# Altium project Evb board STM32F2 Fullcolor V1l0.PrjPcb
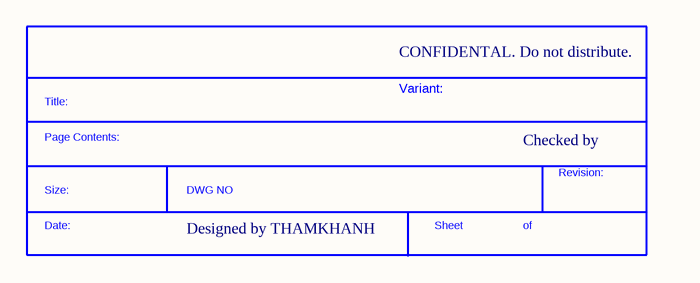
[diagram p0: [02] - BLOCK DIAGRAM.SchDoc]
ClientCompanyName: KAIO; ClientContactEmail: thamkhanhdev@gmail.com; ClientContactName: Khanh Tham; ClientWebsite: Reserved; Company: (c) 2019 KAIO; Note: FREE for personal.; NotFitted: NF; Project: Evb board STM32F2 Fullcolor; VersionRevision: V1I0
4 sheets, 63 parts. Net scope: flat (ports and power ports of the same name join across sheets).
Board file: Evb board STM32F2 Fullcolor V1l0.PcbDoc
Sheets:
  [02] - BLOCK DIAGRAM.SchDoc
  [03] - MAIN FUNC.SchDoc
  [04] - RESERVED CONNECTION.SchDoc
  [05] - REVISION HISTORY.SchDoc

## Sheet [02] - BLOCK DIAGRAM.SchDoc
size A3; DocumentNumber: 2; SheetNumber: 2; SheetTotal: 7

### Parts
(Parts that share a designator on the sheet are numbered #1, #2 ... from top to bottom, then left to right.)
*?#1  SDTitleBlock  (value not drawn)  (graphical)

### Notes on the sheet
- CONFIDENTAL. Do not distribute.
- Variant:
- Checked by
- Designed by THAMKHANH
- (in symbol SDTitleBlock) Title:; Page Contents:; Revision:; Size:; DWG NO; Date:; Sheet; of

## Sheet [03] - MAIN FUNC.SchDoc
size A3; DocumentNumber: 3; SheetNumber: 3; SheetTotal: 7
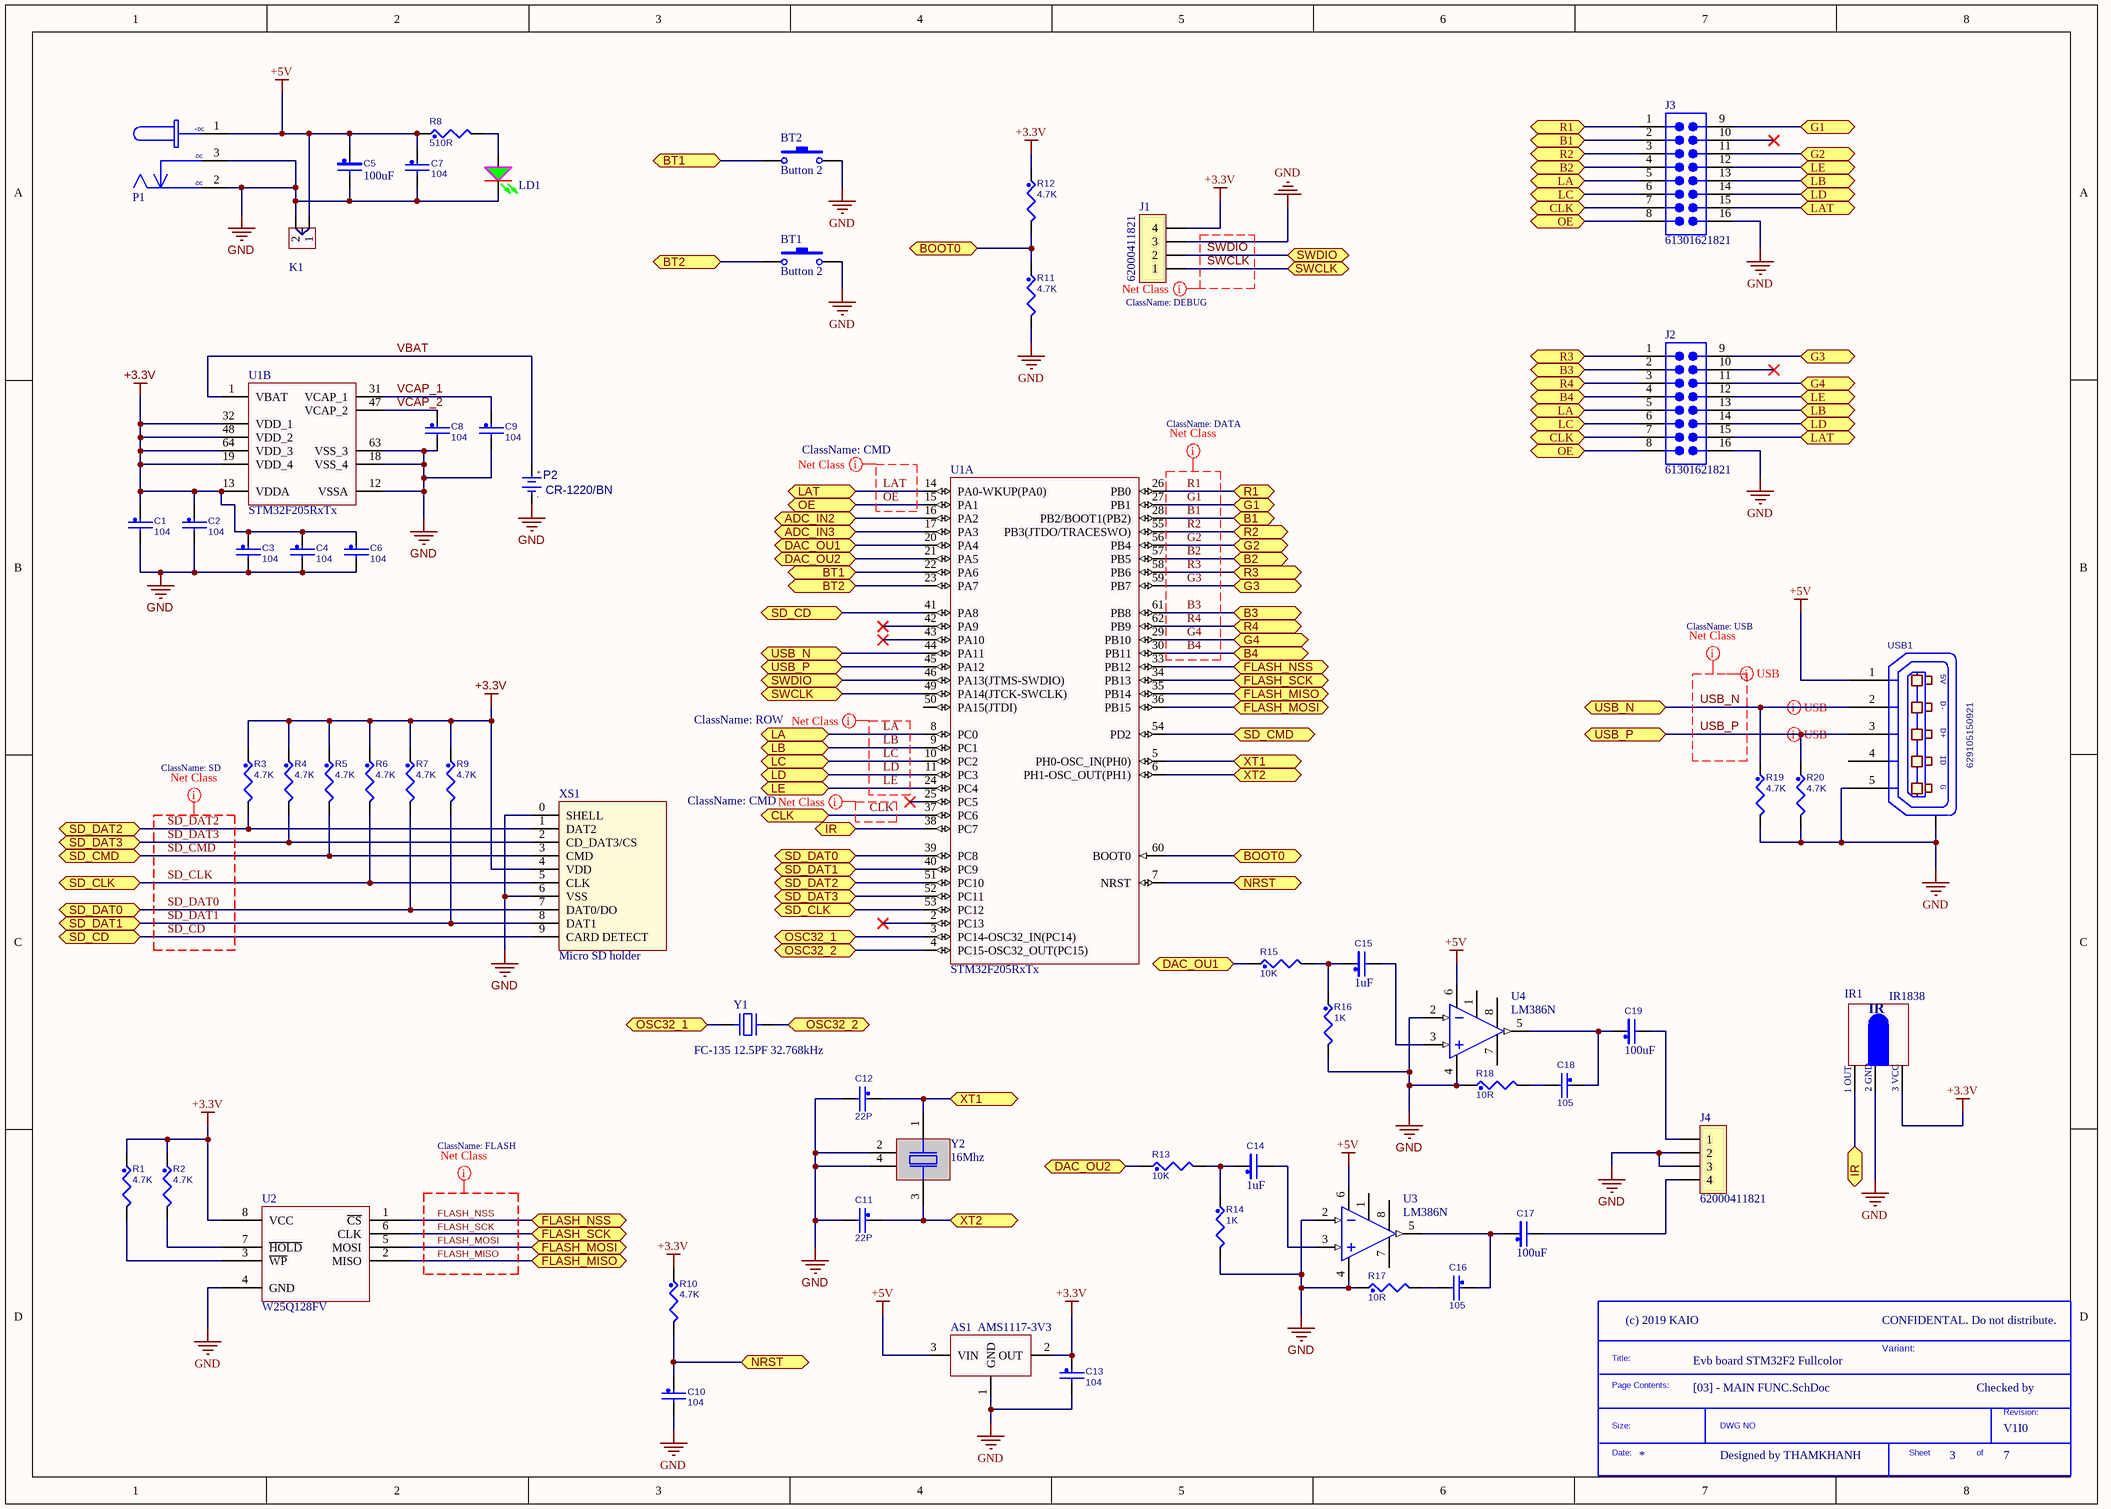
[diagram p1: [03] - MAIN FUNC.SchDoc]

### Parts
(Parts that share a designator on the sheet are numbered #1, #2 ... from top to bottom, then left to right.)
*?#2  SDTitleBlock  (value not drawn)  (graphical)
AS1  AMS1117-3V3  [SOT223-BCE]
BT1  Button 2  [BT-2P0604B1V]
BT2  Button 2  [BT-2P0604B1V]
C1  104  [C0603]
C2  104  [C0603]
C3  104  [C0603]
C4  104  [C0603]
C5  100uF  [CAP-TAN-SMD-3530]
C6  104  [C0603]
C7  104  [C0603]
C8  104  [C0603]
C9  104  [C0603]
C10  104  [C0603]
C11  22P  [C0603]
C12  22P  [C0603]
C13  104  [C0603]
C14  1uF  [CAP-TAN-SMD-3216]
C15  1uF  [CAP-TAN-SMD-3216]
C16  105  [C0603]
C17  100uF  [CAP-TAN-SMD-3530]
C18  105  [C0603]
C19  100uF  [CAP-TAN-SMD-3530]
IR1  IR1838  [IR RECEIVE V1]
J1  62000411821  [62000411121]
J2  61301621821  [61301621821]
J3  61301621821  [61301621821]
J4  62000411821  [62000411121]
K1  KF2  [KF5.08 2DV]  (value not drawn)
LD1  LED SMD  [LED 0805/2012 BLUE]  (value not drawn)
P1  DCIN  [DC-694108301002]  (value not drawn)
P2  CR-1220/BN  [PIN-CR1220-SMD]
R1  4.7K  [R0603]
R2  4.7K  [R0603]
R3  4.7K  [R0603]
R4  4.7K  [R0603]
R5  4.7K  [R0603]
R6  4.7K  [R0603]
R7  4.7K  [R0603]
R8  510R  [R0603]
R9  4.7K  [R0603]
R10  4.7K  [R0603]
R11  4.7K  [R0603]
R12  4.7K  [R0603]
R13  10K  [R0603]
R14  1K  [R0603]
R15  10K  [R0603]
R16  1K  [R0603]
R17  10R  [R0603]
R18  10R  [R0603]
R19  4.7K  [R0603]
R20  4.7K  [R0603]
U1  STM32F205RxTx  [QFP50P1000X1000-64N]  (parts A,B of 2)
U2  W25Q128FV  [SOIC127P530X530-8N]
U3  LM386N  [SOIC127P390X490-8N]
U4  LM386N  [SOIC127P390X490-8N]
USB1  629105150921  [USB-629105150921]
XS1  Micro SD holder  [SD-CARD-MICRO-V3]
Y1  FC-135 12.5PF 32.768kHz  [XT2-3215-2V]
Y2  16Mhz  [XT4-2520NX-SA]

### Ports
ADC_IN2 (bidir), ADC_IN3 (bidir), B1 (bidir), B2 (bidir), B3 (bidir), B4 (bidir), BOOT0 (bidir), BT1 (bidir), BT2 (bidir), CLK (bidir), DAC_OU1 (bidir), DAC_OU2 (bidir), FLASH_MISO (bidir), FLASH_MOSI (bidir), FLASH_NSS (bidir), FLASH_SCK (bidir), G1 (bidir), G2 (bidir), G3 (bidir), G4 (bidir), IR (bidir), LA (bidir), LAT (bidir), LB (bidir), LC (bidir), LD (bidir), LE (bidir), NRST (bidir), OE (bidir), OSC32_1 (bidir), OSC32_2 (bidir), R1 (bidir), R2 (bidir), R3 (bidir), R4 (bidir), SD_CD (bidir), SD_CLK (bidir), SD_CMD (bidir), SD_DAT0 (bidir), SD_DAT1 (bidir), SD_DAT2 (bidir), SD_DAT3 (bidir), SWCLK (bidir), SWDIO (bidir), USB_N (bidir), USB_P (bidir), XT1 (bidir), XT2 (bidir)

### Nets
+3.3V: AS1.2(OUT) C1.1 C2.1 C3.1 C4.1 C6.1 C13.1 IR1.3(VCC) J1.4 R1.1 R2.1 R3.1 R4.1 R5.1 R6.1 R7.1 R9.1 R10.1 R12.1 U1.13(VDDA) U1.19(VDD_4) U1.32(VDD_1) U1.48(VDD_2) U1.64(VDD_3) U2.8(VCC) XS1.4(VDD)
+5V: AS1.3(VIN) C5.1 C7.1 K1.1 P1.1 R8.1 U3.6(+V) U4.6(+V) USB1.1(P1)
GND: AS1.1(GND) BT1.2 BT2.2 C1.2 C2.2 C3.2 C4.2 C5.2 C6.2 C7.2 C8.2 C9.2 C10.2 C11.2 C12.2 C13.2 IR1.2(GND) J1.3 J2.16 J3.16 J4.2 J4.3 K1.2 LD1.2(K) P1.2 P1.3 P2.2(GND) R11.2 R14.2 R16.2 R17.1 R18.1 R19.2 R20.2 U1.12(VSSA) U1.18(VSS_4) U1.63(VSS_3) U2.4(GND) U3.2(IN-) U3.4(-V) U4.2(IN-) U4.4(-V) USB1.0(GND) USB1.5(P5) XS1.0(SHELL) XS1.6(VSS) Y2.2(GND) Y2.4(GND)
ADC_IN2: U1.16(PA2) ; port ADC_IN2
ADC_IN3: U1.17(PA3) ; port ADC_IN3
B1: J3.2 U1.28(PB2/BOOT1(PB2)) ; port B1
B2: J3.4 U1.57(PB5) ; port B2
B3: J2.2 U1.61(PB8) ; port B3
B4: J2.4 U1.30(PB11) ; port B4
BOOT0: R11.1 R12.2 U1.60(BOOT0) ; port BOOT0
BT1: BT2.1 U1.22(PA6) ; port BT1
BT2: BT1.1 U1.23(PA7) ; port BT2
CLK: J2.7 J3.7 U1.37(PC6) ; port CLK
DAC_OU1: R15.1 U1.20(PA4) ; port DAC_OU1
DAC_OU2: R13.1 U1.21(PA5) ; port DAC_OU2
FLASH_MISO: U1.35(PB14) U2.2(MISO) ; port FLASH_MISO
FLASH_MOSI: U1.36(PB15) U2.5(MOSI) ; port FLASH_MOSI
FLASH_NSS: U1.33(PB12) U2.1(~{CS}) ; port FLASH_NSS
FLASH_SCK: U1.34(PB13) U2.6(CLK) ; port FLASH_SCK
G1: J3.9 U1.27(PB1) ; port G1
G2: J3.11 U1.56(PB4) ; port G2
G3: J2.9 U1.59(PB7) ; port G3
G4: J2.11 U1.29(PB10) ; port G4
IR: IR1.1(Out) U1.38(PC7) ; port IR
LA: J2.5 J3.5 U1.8(PC0) ; port LA
LAT: J2.15 J3.15 U1.14(PA0-WKUP(PA0)) ; port LAT
LB: J2.13 J3.13 U1.9(PC1) ; port LB
LC: J2.6 J3.6 U1.10(PC2) ; port LC
LD: J2.14 J3.14 U1.11(PC3) ; port LD
LE: J2.12 J3.12 U1.24(PC4) ; port LE
NRST: C10.1 R10.2 U1.7(NRST) ; port NRST
OE: J2.8 J3.8 U1.15(PA1) ; port OE
OSC32_1: U1.3(PC14-OSC32_IN(PC14)) Y1.1 ; port OSC32_1
OSC32_2: U1.4(PC15-OSC32_OUT(PC15)) Y1.2 ; port OSC32_2
R1: J3.1 U1.26(PB0) ; port R1
R2: J3.3 U1.55(PB3(JTDO/TRACESWO)) ; port R2
R3: J2.1 U1.58(PB6) ; port R3
R4: J2.3 U1.62(PB9) ; port R4
SD_CD: U1.41(PA8) XS1.9(CARD_DETECT) ; port SD_CD
SD_CLK: R6.2 U1.53(PC12) XS1.5(CLK) ; port SD_CLK
SD_CMD: R5.2 U1.54(PD2) XS1.3(CMD) ; port SD_CMD
SD_DAT0: R7.2 U1.39(PC8) XS1.7(DAT0/DO) ; port SD_DAT0
SD_DAT1: R9.2 U1.40(PC9) XS1.8(DAT1) ; port SD_DAT1
SD_DAT2: R3.2 U1.51(PC10) XS1.1(DAT2) ; port SD_DAT2
SD_DAT3: R4.2 U1.52(PC11) XS1.2(CD_DAT3/CS) ; port SD_DAT3
SWCLK: J1.1 U1.49(PA14(JTCK-SWCLK)) ; port SWCLK
SWDIO: J1.2 U1.46(PA13(JTMS-SWDIO)) ; port SWDIO
USB_N: R19.1 U1.44(PA11) USB1.2(P2) ; port USB_N
USB_P: R20.1 U1.45(PA12) USB1.3(P3) ; port USB_P
VBAT: P2.1(+3V) U1.1(VBAT)
VCAP_1: C9.1 U1.31(VCAP_1)
VCAP_2: C8.1 U1.47(VCAP_2)
XT1: C12.1 U1.5(PH0-OSC_IN(PH0)) Y2.1(X1) ; port XT1
XT2: C11.1 U1.6(PH1-OSC_OUT(PH1)) Y2.3(X2) ; port XT2
NetC14_1: C14.1 R13.2 R14.1
NetC14_2: C14.2 U3.3(IN+)
NetC15_1: C15.1 R15.2 R16.1
NetC15_2: C15.2 U4.3(IN+)
NetC16_1: C16.1 C17.1 U3.5(OUT)
NetC16_2: C16.2 R17.2
NetC17_2: C17.2 J4.4
NetC18_1: C18.1 C19.1 U4.5(OUT)
NetC18_2: C18.2 R18.2
NetC19_2: C19.2 J4.1
NetLD1_1: LD1.1(A) R8.2
NetR1_2: R1.2 U2.3(~{WP})
NetR2_2: R2.2 U2.7(~{HOLD})

Not connected (* = marked no-connect by the designer): J2 10*; J3 10*; U1 2(PC13)* 25(PC5)* 42(PA9)* 43(PA10)* 50(PA15(JTDI)); U3 1(-V) 7 8(-V); U4 1(-V) 7 8(-V); USB1 4(P4)

### Layout directives
differential pair: USB_N, USB_P
net class FLASH: FLASH_MISO, FLASH_MOSI, FLASH_NSS, FLASH_SCK
net class SD: SD_CD, SD_CLK, SD_CMD, SD_DAT0, SD_DAT1, SD_DAT2, SD_DAT3
net class USB: USB_N, USB_P
net class DATA: B1, B2, B3, B4, G1, G2, G3, G4, R1, R2, R3, R4
net class ROW: LA, LB, LC, LD, LE
net class CMD: CLK, LAT, OE
net class DEBUG: SWCLK, SWDIO

### Notes on the sheet
- CONFIDENTAL. Do not distribute.
- Variant:
- Checked by
- Designed by THAMKHANH
- (in symbol DCIN) +DC; -DC
- (in symbol IR1838) IR; 1 OUT; 2 GND; 3 VCC
- (in symbol PIN-CR-1220/BN) +; -
- (in symbol SDTitleBlock) Title:; Page Contents:; Revision:; Size:; DWG NO; Date:; Sheet; of
- (in symbol USB 2.0 Micro Type AB Female) 5V; D-; D+; ID; G

### Library data of the parts
AS1 = AMS1117-3V3: 800mA Low-Dropout Linear Regulator
BT1 BT2 = Button 2: Button 2 Pin no Sheld
C1-C4 C6-C13 C16 C18 = CAP-SMD-CERAMIC: Surface Mound Multilayer Ceramic Chip Capacitor (SMD MLCC); Manufacturer: TDK Corporation; Manufacturer Part Number: C2012X5R1C226K; Capacitance: 22pF; Voltage - Rated: 16V; Tolerance: ±10%; Temperature Coefficient: X5R; .Checked PCB: RF; RoHS: RoHS Compliant; Category: Capacitors; Mounting Type: Surface Mount, MLCC; Operating Temperature: -55°C ~ 85°C; Applications: General Purpose; Ratings: -; Package / Case: 0805 (2012 Metric); Size / Dimension: 0.079" L x 0.049" W (2.00mm x 1.25mm); Height - Seated (Max): -; Thickness (Max): 0.057" (1.45mm); Lead Spacing: -; Features: -; Packaging: Cut Tape (CT); Lead Style: -; ComponentLink1URL: http://www.tdk.com/pdf/general_B11.pdf; ComponentLink1Description: http://www.tdk.com/pdf/general_B11.pdf; .Checked SCH: RF
C5 C17 C19 = CAP-SMD-TANTALUM: Tantalum capacitor , T491A475K016AT, KEMET; Manufacturer Part Number: T491A105K016AT; Capacitance: 1uF; Tolerance: 20%; Voltage Rating: 16V; ESR (Equivalent Series Resistance): 10R; Leakage Current: 500nA; Polarity: Polar; Dissipation Factor: 4%; Life (Hours): 2000Hour; Ripple Current: 87mA; Manufacturer: KEMET; Mount: Surface Mount,PCB; Case/Package: 1206; Number of Pins: 2; Case Code (Imperial): 1206; Case Code (Metric): 3216; Dielectric Material: Tantalum; Min Operating Temperature: -55°C; Max Operating Temperature: 125°C; Packaging: Tape and Reel; Package Quantity: 1; Voltage Rating (DC): 16V; Termination: SMD/SMT; Voltage: 16V; Features: General Purpose; Length: 3.2mm; Height: 1.6mm; Width: 1.6mm; Height - Seated (Max): 0.071inch; Depth: 1.6mm; REACH SVHC: No SVHC; Lead Free: Lead Free; ComponentLink1URL: https://4donline.ihs.com/images/VipMasterIC/IC/KEME/KEME-S-A0006487387/KEME-S-A0006487387-1.pdf?hkey=52A5661711E402568146F3353EA87419&src-supplier=Element14; ComponentLink1Description: https://4donline.ihs.com/images/VipMasterIC/IC/KEME/KEME-S-A0006487387/KEME-S-A0006487387-1.pdf?hkey=52A5661711E402568146F3353EA87419&src-supplier=Element14; ComponentLink2URL: http://www.rapidonline.com/pdf/458280_da_en_01.pdf?src-supplier=Rapid+Electronics; ComponentLink2Description: http://www.rapidonline.com/pdf/458280_da_en_01.pdf?src-supplier=Rapid+Electronics; ComponentLink3URL: http://www.jameco.com/Jameco/Products/ProdDS/1573169.pdf?src-supplier=Jameco; ComponentLink3Description: http://www.jameco.com/Jameco/Products/ProdDS/1573169.pdf?src-supplier=Jameco; ComponentLink4URL: http://www.kemet.com/kemet/web/homepage/kechome.nsf/file/T491%20Series/$file/KEM_T2005_T491.pdf?src-supplier=Farnell; ComponentLink4Description: http://www.kemet.com/kemet/web/homepage/kechome.nsf/file/T491%20Series/$file/KEM_T2005_T491.pdf?src-supplier=Farnell; ComponentLink5URL: http://www.mouser.com/ds/2/212/KEM_T2005_T491-1093550.pdf?src-supplier=Mouser; ComponentLink5Description: http://www.mouser.com/ds/2/212/KEM_T2005_T491-1093550.pdf?src-supplier=Mouser; ComponentLink6URL: https://www.distrelec.biz/Web/Downloads/_t/ds/KEM_T2005_T491_eng_tds.pdf?mime=application%2Fpdf&src-supplier=Distrelec; ComponentLink6Description: https://www.distrelec.biz/Web/Downloads/_t/ds/KEM_T2005_T491_eng_tds.pdf?mime=application%2Fpdf&src-supplier=Distrelec; ComponentLink7URL: https://api.kemet.com/component-edge/download/datasheet/T491A105K016AT.pdf?src-supplier=Digi-Key; ComponentLink7Description: https://api.kemet.com/component-edge/download/datasheet/T491A105K016AT.pdf?src-supplier=Digi-Key; ComponentLink8URL: http://www.kemet.com/kemet/web/homepage/kechome.nsf/file/T491%20Series/$file/KEM_T2005_T491.pdf?src-supplier=Element14; ComponentLink8Description: http://www.kemet.com/kemet/web/homepage/kechome.nsf/file/T491%20Series/$file/KEM_T2005_T491.pdf?src-supplier=Element14; ComponentLink9URL: http://uk.rs-online.com/webdocs/1529/0900766b815290c9.pdf?src-supplier=RSComponents; ComponentLink9Description: http://uk.rs-online.com/webdocs/1529/0900766b815290c9.pdf?src-supplier=RSComponents; ComponentLink10URL: https://www.alliedelec.com/m/d/1172a60f7bb3eb66344f86e8fb9ddbde.pdf?src-supplier=Allied+Electronics; ComponentLink10Description: https://www.alliedelec.com/m/d/1172a60f7bb3eb66344f86e8fb9ddbde.pdf?src-supplier=Allied+Electronics; Radiation Hardening: No; ComponentLink11URL: https://api.kemet.com/component-edge/download/datasheet/T491A475K016AT.pdf?src-supplier=Digi-Key; ComponentLink11Description: https://api.kemet.com/component-edge/download/datasheet/T491A475K016AT.pdf?src-supplier=Digi-Key; ComponentLink12URL: http://www.jameco.com/Jameco/Products/ProdDS/1573425.pdf?src-supplier=Jameco; ComponentLink12Description: http://www.jameco.com/Jameco/Products/ProdDS/1573425.pdf?src-supplier=Jameco; ComponentLink13URL: http://uk.rs-online.com/webdocs/1515/0900766b81515525.pdf?src-supplier=RSComponents; ComponentLink13Description: http://uk.rs-online.com/webdocs/1515/0900766b81515525.pdf?src-supplier=RSComponents; ComponentLink14URL: http://www.farnell.com/datasheets/1854511.pdf?src-supplier=Element14; ComponentLink14Description: http://www.farnell.com/datasheets/1854511.pdf?src-supplier=Element14; ComponentLink15URL: http://www.rapidonline.com/pdf/458253_da_en_01.pdf?src-supplier=Rapid+Electronics; ComponentLink15Description: http://www.rapidonline.com/pdf/458253_da_en_01.pdf?src-supplier=Rapid+Electronics; ComponentLink16URL: https://produktinfo.conrad.com/datenblaetter/450000-474999/458253-da-01-en-TANTAL_KONDENSATOR_T491A475K016AT.pdf?src-supplier=Conrad; ComponentLink16Description: https://produktinfo.conrad.com/datenblaetter/450000-474999/458253-da-01-en-TANTAL_KONDENSATOR_T491A475K016AT.pdf?src-supplier=Conrad
C14 C15 = CAP-SMD-TANTALUM: Tantalum capacitor , T491A475K016AT, KEMET; Manufacturer Part Number: T491A105K016AT; Tolerance: 20%; Voltage Rating: 16V; ESR (Equivalent Series Resistance): 10R; Leakage Current: 500nA; Polarity: Polar; Dissipation Factor: 4%; Life (Hours): 2000Hour; Ripple Current: 87mA; Manufacturer: KEMET; Mount: Surface Mount,PCB; Case/Package: 1206; Number of Pins: 2; Case Code (Imperial): 1206; Case Code (Metric): 3216; Dielectric Material: Tantalum; Min Operating Temperature: -55°C; Max Operating Temperature: 125°C; Capacitance: 1uF; Packaging: Tape and Reel; Package Quantity: 1; Voltage Rating (DC): 16V; Termination: SMD/SMT; Voltage: 16V; Features: General Purpose; Length: 3.2mm; Height: 1.6mm; Width: 1.6mm; Height - Seated (Max): 0.071inch; Depth: 1.6mm; REACH SVHC: No SVHC; Lead Free: Lead Free; ComponentLink1URL: https://4donline.ihs.com/images/VipMasterIC/IC/KEME/KEME-S-A0006487387/KEME-S-A0006487387-1.pdf?hkey=52A5661711E402568146F3353EA87419&src-supplier=Element14; ComponentLink1Description: https://4donline.ihs.com/images/VipMasterIC/IC/KEME/KEME-S-A0006487387/KEME-S-A0006487387-1.pdf?hkey=52A5661711E402568146F3353EA87419&src-supplier=Element14; ComponentLink2URL: http://www.rapidonline.com/pdf/458280_da_en_01.pdf?src-supplier=Rapid+Electronics; ComponentLink2Description: http://www.rapidonline.com/pdf/458280_da_en_01.pdf?src-supplier=Rapid+Electronics; ComponentLink3URL: http://www.jameco.com/Jameco/Products/ProdDS/1573169.pdf?src-supplier=Jameco; ComponentLink3Description: http://www.jameco.com/Jameco/Products/ProdDS/1573169.pdf?src-supplier=Jameco; ComponentLink4URL: http://www.kemet.com/kemet/web/homepage/kechome.nsf/file/T491%20Series/$file/KEM_T2005_T491.pdf?src-supplier=Farnell; ComponentLink4Description: http://www.kemet.com/kemet/web/homepage/kechome.nsf/file/T491%20Series/$file/KEM_T2005_T491.pdf?src-supplier=Farnell; ComponentLink5URL: http://www.mouser.com/ds/2/212/KEM_T2005_T491-1093550.pdf?src-supplier=Mouser; ComponentLink5Description: http://www.mouser.com/ds/2/212/KEM_T2005_T491-1093550.pdf?src-supplier=Mouser; ComponentLink6URL: https://www.distrelec.biz/Web/Downloads/_t/ds/KEM_T2005_T491_eng_tds.pdf?mime=application%2Fpdf&src-supplier=Distrelec; ComponentLink6Description: https://www.distrelec.biz/Web/Downloads/_t/ds/KEM_T2005_T491_eng_tds.pdf?mime=application%2Fpdf&src-supplier=Distrelec; ComponentLink7URL: https://api.kemet.com/component-edge/download/datasheet/T491A105K016AT.pdf?src-supplier=Digi-Key; ComponentLink7Description: https://api.kemet.com/component-edge/download/datasheet/T491A105K016AT.pdf?src-supplier=Digi-Key; ComponentLink8URL: http://www.kemet.com/kemet/web/homepage/kechome.nsf/file/T491%20Series/$file/KEM_T2005_T491.pdf?src-supplier=Element14; ComponentLink8Description: http://www.kemet.com/kemet/web/homepage/kechome.nsf/file/T491%20Series/$file/KEM_T2005_T491.pdf?src-supplier=Element14; ComponentLink9URL: http://uk.rs-online.com/webdocs/1529/0900766b815290c9.pdf?src-supplier=RSComponents; ComponentLink9Description: http://uk.rs-online.com/webdocs/1529/0900766b815290c9.pdf?src-supplier=RSComponents; ComponentLink10URL: https://www.alliedelec.com/m/d/1172a60f7bb3eb66344f86e8fb9ddbde.pdf?src-supplier=Allied+Electronics; ComponentLink10Description: https://www.alliedelec.com/m/d/1172a60f7bb3eb66344f86e8fb9ddbde.pdf?src-supplier=Allied+Electronics; Radiation Hardening: No; ComponentLink11URL: https://api.kemet.com/component-edge/download/datasheet/T491A475K016AT.pdf?src-supplier=Digi-Key; ComponentLink11Description: https://api.kemet.com/component-edge/download/datasheet/T491A475K016AT.pdf?src-supplier=Digi-Key; ComponentLink12URL: http://www.jameco.com/Jameco/Products/ProdDS/1573425.pdf?src-supplier=Jameco; ComponentLink12Description: http://www.jameco.com/Jameco/Products/ProdDS/1573425.pdf?src-supplier=Jameco; ComponentLink13URL: http://uk.rs-online.com/webdocs/1515/0900766b81515525.pdf?src-supplier=RSComponents; ComponentLink13Description: http://uk.rs-online.com/webdocs/1515/0900766b81515525.pdf?src-supplier=RSComponents; ComponentLink14URL: http://www.farnell.com/datasheets/1854511.pdf?src-supplier=Element14; ComponentLink14Description: http://www.farnell.com/datasheets/1854511.pdf?src-supplier=Element14; ComponentLink15URL: http://www.rapidonline.com/pdf/458253_da_en_01.pdf?src-supplier=Rapid+Electronics; ComponentLink15Description: http://www.rapidonline.com/pdf/458253_da_en_01.pdf?src-supplier=Rapid+Electronics; ComponentLink16URL: https://produktinfo.conrad.com/datenblaetter/450000-474999/458253-da-01-en-TANTAL_KONDENSATOR_T491A475K016AT.pdf?src-supplier=Conrad; ComponentLink16Description: https://produktinfo.conrad.com/datenblaetter/450000-474999/458253-da-01-en-TANTAL_KONDENSATOR_T491A475K016AT.pdf?src-supplier=Conrad
IR1 = IR1838: VISHAY SEMICONDUCTOR   TSOP31238   IR RECEIVER, 40M, 38KHZ, SIP
J1 J4 = JP4 2.00MM Single Socket: WR-PHD 2.00 mm Socket Header; Manufacturer: W¨¹rth Elektronik eiSos GmbH; ComponentLink1 Description: Manufacturer; ComponentLink2 Description: Datasheet; NoPins: 04; Created Date: 2 April 2013; partNo: 62000411821; ComponentLink1URL: http://www.we-online.com; ComponentLink2URL: http://katalog.we-online.de/em/datasheet/6200xx11821.pdf; Created by: Karrer Zheng
J2 J3 = JP8 2.54MM Dual Socket: 2.54 mm Dual Socket Header, 16p; PublishedDate: July 2016; Publisher: Wurth Elektronik; ComponentLink1Description: Manufacturer; ComponentLink1URL: http://www.we-online.de; ComponentLink2Description: Datasheet; ComponentLink2URL: http://katalog.we-online.de/em/datasheet/6130xx21821.pdf; PartNumber: 61301621821; PinNumber: 16p
K1 = KF2: KF2, 5.08mm, 10A, 300V, -40C ~ 105C
LD1 = LED SMD: LED DIFFUSED SMD
P1 = DCIN: TBD
P2 = PIN-CR-1220/BN: PANASONIC - CR-1220/BN - BATTERY, LITHIUM, CR1220; Capacity: 35mAh; Voltage Rating (DC): 3V; Outside Diameter: 12.5mm; Manufacturer: Panasonic; Manufacturer Part Number: CR-1220/BN; Weight: 1.2g; Min Operating Temperature: -30°C; Max Operating Temperature: 60°C; Chemistry/Technology: Lithium; Termination: Standard; Diameter: 12.5mm; Height: 2mm; Lead Free: Lead Free; REACH SVHC: Yes; ComponentLink1URL: http://uk.rs-online.com/webdocs/0c85/0900766b80c85259.pdf?src-supplier=RSComponents; ComponentLink1Description: http://uk.rs-online.com/webdocs/0c85/0900766b80c85259.pdf?src-supplier=RSComponents
R1-R20 = RES-SMD: RES 0R OHM 1/8W 1% SMD; Manufacturer: Yageo; Manufacturer Part Number: RC0402FR-0749R9L; Power (Watts): 0.063W, 1/16W; .Checked PCB: used; Temperature Coefficient: ±100ppm/°C; Resistance: 3.3kR; Power Rating: 125mW; Voltage Rating: 100V; Category: Resistors; Supplier Part Number: 311-49.9LRCT-ND; Package / Case: 0402 (1005 Metric); Price 1k [$]: 0.01421; Tolerance: ±1%; Value: 0R; .Checked SCH: used; Supplier: Digikey; RoHS: RoHS Compliant; Composition: Thick Film; Features: -; Size / Dimension: 0.039" L x 0.020" W (1.00mm x 0.50mm); Height: 0.016" (0.40mm); Number of Terminations: 2; Packaging: Cut Tape (CT); ComponentLink1URL: http://www.yageo.com/documents/recent/PYu-RC0402_51_RoHS_L_6.pdf; ComponentLink1Description: http://www.yageo.com/documents/recent/PYu-RC0402_51_RoHS_L_6.pdf; Resistance (Ohms): 0R; Mount: Surface Mount; Case/Package: 0805; Number of Pins: 2; Contact Plating: Tin; Case Code (Metric): 2012; Case Code (Imperial): 0805; Min Operating Temperature: -55°C; Max Operating Temperature: 155°C; Package Quantity: 1; Termination: SMD/SMT; Military Standard: Not; Max Power Dissipation: 125mW; Voltage Rating (DC): 100V; Length: 2mm; Width: 1.25mm; Depth: 1.25mm; Radiation Hardening: No; REACH SVHC: No SVHC; Lead Free: Lead Free; ComponentLink2URL: http://www.farnell.com/datasheets/485442.pdf?src-supplier=Farnell; ComponentLink2Description: http://www.farnell.com/datasheets/485442.pdf?src-supplier=Farnell; ComponentLink3URL: http://uk.rs-online.com/webdocs/0bee/0900766b80beefcc.pdf?src-supplier=RSComponents; ComponentLink3Description: http://uk.rs-online.com/webdocs/0bee/0900766b80beefcc.pdf?src-supplier=RSComponents; ComponentLink4URL: http://industrial.panasonic.com/www-data/pdf/AOA0000/AOA0000CE26.pdf?src-supplier=Future+Electronics; ComponentLink4Description: http://industrial.panasonic.com/www-data/pdf/AOA0000/AOA0000CE26.pdf?src-supplier=Future+Electronics; ComponentLink5URL: https://www.alliedelec.com/m/d/b6b0537e86f421aa7f5975bb1d8f429a.pdf?src-supplier=Allied+Electronics; ComponentLink5Description: https://www.alliedelec.com/m/d/b6b0537e86f421aa7f5975bb1d8f429a.pdf?src-supplier=Allied+Electronics; ComponentLink6URL: http://industrial.panasonic.com/www-data/pdf/AOA0000/AOA0000CE26.pdf?src-supplier=Avnet; ComponentLink6Description: http://industrial.panasonic.com/www-data/pdf/AOA0000/AOA0000CE26.pdf?src-supplier=Avnet; ComponentLink7URL: http://industrial.panasonic.com/www-data/pdf/AOA0000/AOA0000CE26.pdf?src-supplier=Avnet+Europe; ComponentLink7Description: http://industrial.panasonic.com/www-data/pdf/AOA0000/AOA0000CE26.pdf?src-supplier=Avnet+Europe; ComponentLink8URL: http://industrial.panasonic.com/cdbs/www-data/pdf/RDM0000/AOA0000C307.pdf?src-supplier=Farnell; ComponentLink8Description: http://industrial.panasonic.com/cdbs/www-data/pdf/RDM0000/AOA0000C307.pdf?src-supplier=Farnell; ComponentLink9URL: https://www.distrelec.biz/Web/Downloads/_t/ds/ERA_eng_tds.pdf?mime=application%2Fpdf&src-supplier=Distrelec; ComponentLink9Description: https://www.distrelec.biz/Web/Downloads/_t/ds/ERA_eng_tds.pdf?mime=application%2Fpdf&src-supplier=Distrelec; ComponentLink10URL: http://www.farnell.com/datasheets/485442.pdf?src-supplier=Element14; ComponentLink10Description: http://www.farnell.com/datasheets/485442.pdf?src-supplier=Element14; ComponentLink11URL: http://www.farnell.com/datasheets/2052875.pdf?src-supplier=Farnell; ComponentLink11Description: http://www.farnell.com/datasheets/2052875.pdf?src-supplier=Farnell; ComponentLink12URL: http://www.farnell.com/datasheets/2059650.pdf?src-supplier=Farnell; ComponentLink12Description: http://www.farnell.com/datasheets/2059650.pdf?src-supplier=Farnell; ComponentLink13URL: https://produktinfo.conrad.com/datenblaetter/450000-474999/453184-da-01-en-WIDERSTAND_0805_ERA.pdf?src-supplier=Conrad; ComponentLink13Description: https://produktinfo.conrad.com/datenblaetter/450000-474999/453184-da-01-en-WIDERSTAND_0805_ERA.pdf?src-supplier=Conrad
U1 = STM32F205RxTx: ARM Cortex-M3 32-bit MCU, 1024 KB Flash, 128 KB Internal RAM, 51 I/Os, 64-pin LQFP, -40 to 105 degC, Tray; PartNumber: STM32F205RGT7; D/A Converter: 2x12-bit (2 Channel); FLASH Size (Prog) (kB): 1024; I/Os (High Current): 51; Internal RAM Size (kB): 128; Operating Frequency(F) (Processor speed) (MHz): 120; Supply Voltage(Vcc) min (V): 1.8; DatasheetVersion: Rev. 9; PackageVersion: Rev. 4, 06/2013; PackageReference: LQFP64; PackageDescription: 64-Pin Low Profile Quad Flat Package, 10 x 10 mm Body, 0.5 mm Pitch; Core: ARM Cortex-M3; Packing: Tray; Mounting Technology: Surface Mount; ComponentLink1Description: Manufacturer URL; ComponentLink1URL: http://www.st.com/web/en/home.html; ComponentLink2Description: Datasheet; ComponentLink2URL: http://www.st.com/st-web-ui/static/active/en/resource/technical/document/datasheet/CD00237391.pdf; ComponentLink3Description: Package Specification; ComponentLink3URL: http://www.st.com/st-web-ui/static/active/en/resource/technical/document/datasheet/DM00037051.pdf
U3 U4 = LM386N: TEXAS INSTRUMENTS         LM386N-3/NOPB            AUDIO POWER AMPLIFIER, CLASS AB, 700mW DIP-8
USB1 = USB 2.0 Micro Type AB Female: Micro USB 2.0 Type AB; PartVertical: 614105150621; Interface Type: Type AB; Gender: Receptacle; ComponentLink1Description: Manufacturer; ComponentLink1URL: http://www.we-online.de; ComponentLink2Description: Datasheet; ComponentLink2URL: http://katalog.we-online.de/em/datasheet/629105150921.pdf; PartHorizontal: 629105150921; Published Date: April 2017; Publisher: Wurth Elektronik; Sub-Family: Micro USB 2.0; Type: Horizontal; Construction: SMT
XS1 = SD-CARD-v3
Y1 = XT2-ABLS-X.000MHZ-B2-T: CRYSTAL X.0000MHZ 18PF SMD; Manufacturer: Abracon; Manufacturer Part Number: ABLS-X.000MHZ-B4-T; Frequency Tolerance: 30ppm; Frequency: XMHz; ESR (Equivalent Series Resistance): 80R; Frequency Stability: 50ppm; Mount: Surface Mount; Case/Package: SMD/SMT; Min Operating Temperature: -20°C; Max Operating Temperature: 70°C; Packaging: Tape and Reel; Package Quantity: 1000; Load Capacitance: 18pF; Tolerance: 30ppm; Termination: SMD/SMT; Series Resistance: 80R; Length: 11.4mm; Height: 0.165inch; Depth: 4.7mm; Width: 0.185inch; Radiation Hardening: No; REACH SVHC: Yes; Lead Free: Lead Free; ComponentLink1URL: https://abracon.com/Support/PackageDrawing/Resonators/ABLS-2D.pdf?src-supplier=Digi-Key; ComponentLink1Description: https://abracon.com/Support/PackageDrawing/Resonators/ABLS-2D.pdf?src-supplier=Digi-Key; ComponentLink2URL: http://www.abracon.com/Support/PackageDrawing/Resonators/ABLS-2D.pdf?src-supplier=Avnet; ComponentLink2Description: http://www.abracon.com/Support/PackageDrawing/Resonators/ABLS-2D.pdf?src-supplier=Avnet; ComponentLink3URL: http://www.abracon.com/Support/PackageDrawing/Resonators/ABLS-2D.pdf?src-supplier=Mouser; ComponentLink3Description: http://www.abracon.com/Support/PackageDrawing/Resonators/ABLS-2D.pdf?src-supplier=Mouser
Y2 = XT4: XMHz ±30ppm Crystal 20pF 150 Ohm -20°C ~ 70°C  Surface Mount HC49/US; Manufacturer: Abracon; Manufacturer Part Number: ABM8-24.000MHZ-B2-T; ESR (Equivalent Series Resistance): 50R; Frequency: 24MHz; Load Capacitance: 18pF; Tolerance: 20ppm; Frequency Stability: 50ppm; Mount: Surface Mount; Case/Package: CSMD; Number of Pins: 4; Min Operating Temperature: -20°C; Max Operating Temperature: 70°C; Package Quantity: 1000; Packaging: Tape and Reel; Frequency Tolerance: 20ppm; Termination: SMD/SMT; Series Resistance: 50R; Composition: Ceramic; Accuracy: 20ppm; Length: 3.2mm; Height: 0.031inch; Depth: 2.5mm; Width: 2.5mm; Radiation Hardening: No; REACH SVHC: No SVHC; Lead Free: Lead Free; ComponentLink1URL: http://www.mouser.com/ds/2/3/abm8-16794.pdf?src-supplier=Mouser; ComponentLink1Description: http://www.mouser.com/ds/2/3/abm8-16794.pdf?src-supplier=Mouser; ComponentLink2URL: http://www.farnell.com/datasheets/97450.pdf?src-supplier=Element14; ComponentLink2Description: http://www.farnell.com/datasheets/97450.pdf?src-supplier=Element14; ComponentLink3URL: http://www.abracon.com/Resonators/abm8.pdf?src-supplier=Element14; ComponentLink3Description: http://www.abracon.com/Resonators/abm8.pdf?src-supplier=Element14; ComponentLink4URL: https://www.verical.com/server-webapp/html/getDatasheet?partID=719846&src-supplier=Verical; ComponentLink4Description: https://www.verical.com/server-webapp/html/getDatasheet?partID=719846&src-supplier=Verical; ComponentLink5URL: https://abracon.com/Support/PackageDrawing/Resonators/ABM8.PDF?src-supplier=Digi-Key; ComponentLink5Description: https://abracon.com/Support/PackageDrawing/Resonators/ABM8.PDF?src-supplier=Digi-Key; ComponentLink6URL: http://www.abracon.com/Resonators/abm8.pdf?src-supplier=Digi-Key; ComponentLink6Description: http://www.abracon.com/Resonators/abm8.pdf?src-supplier=Digi-Key; ComponentLink7URL: http://www.abracon.com/Resonators/abm8.pdf?src-supplier=Future+Electronics; ComponentLink7Description: http://www.abracon.com/Resonators/abm8.pdf?src-supplier=Future+Electronics; ComponentLink8URL: http://www.abracon.com/Resonators/abm8.pdf?src-supplier=Farnell; ComponentLink8Description: http://www.abracon.com/Resonators/abm8.pdf?src-supplier=Farnell

## Sheet [04] - RESERVED CONNECTION.SchDoc
size A3; DocumentNumber: 4; SheetNumber: 4; SheetTotal: 7
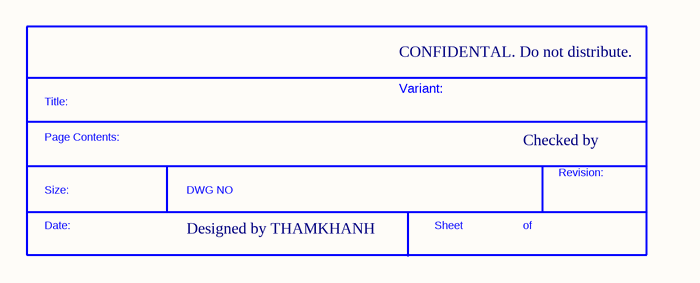
[diagram p2: [04] - RESERVED CONNECTION.SchDoc]

### Parts
(Parts that share a designator on the sheet are numbered #1, #2 ... from top to bottom, then left to right.)
*?#3  SDTitleBlock  (value not drawn)  (graphical)

### Notes on the sheet
- CONFIDENTAL. Do not distribute.
- Variant:
- Checked by
- Designed by THAMKHANH
- (in symbol SDTitleBlock) Title:; Page Contents:; Revision:; Size:; DWG NO; Date:; Sheet; of

## Sheet [05] - REVISION HISTORY.SchDoc
size A3; DocumentNumber: 5; SheetNumber: 5; SheetTotal: 7
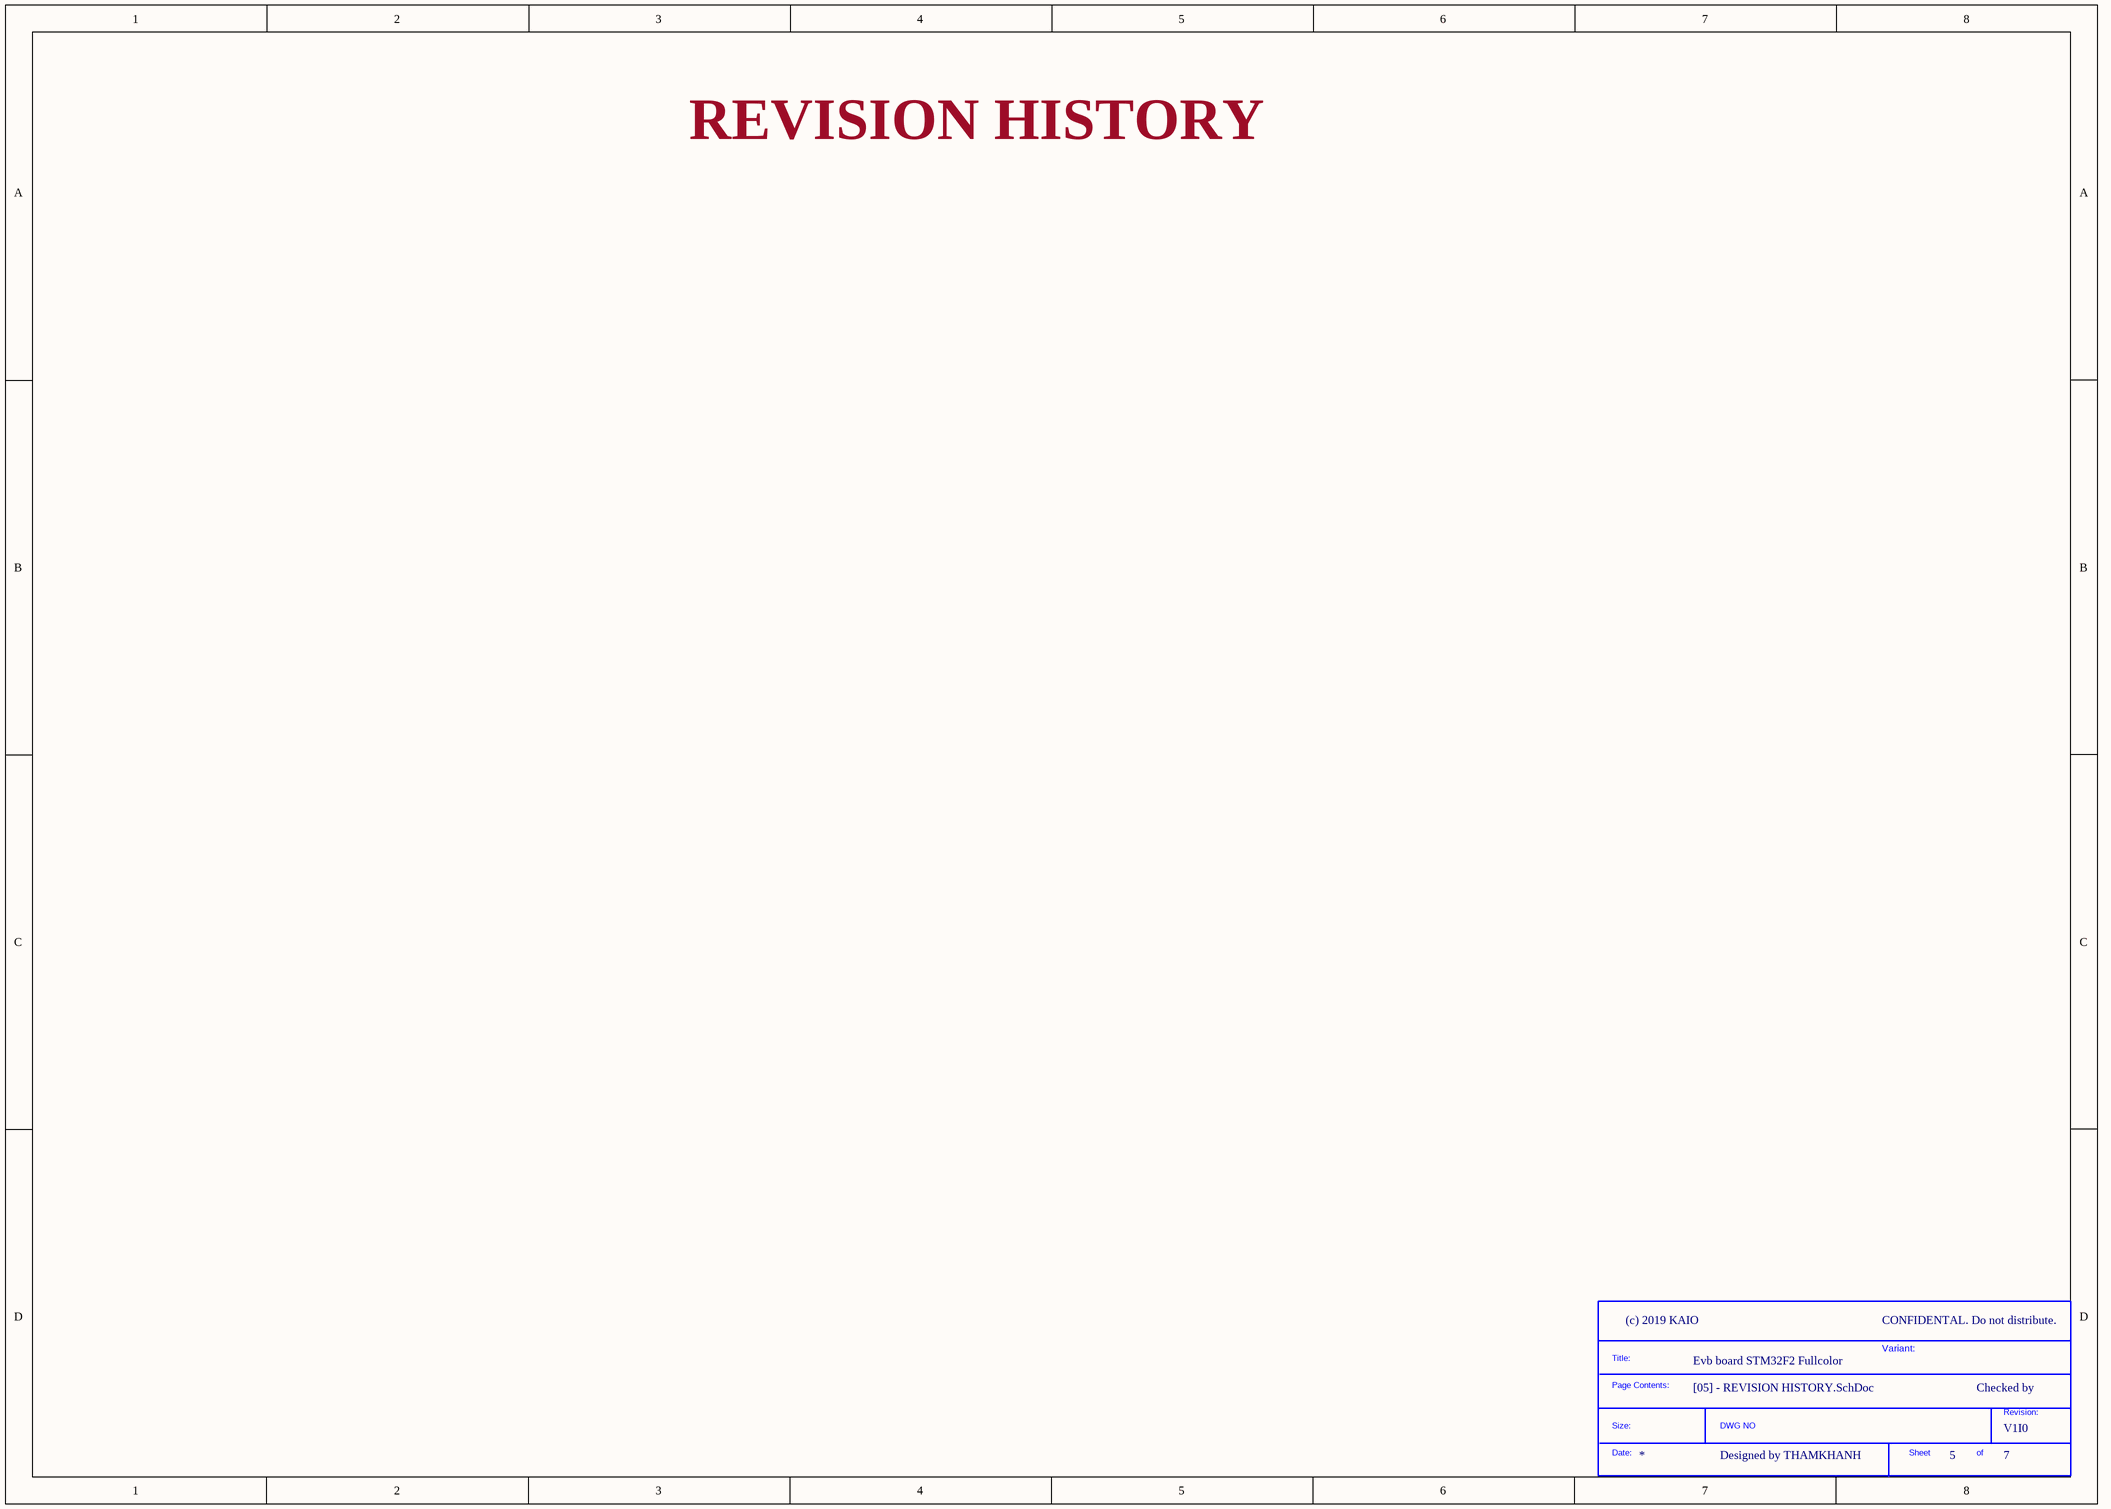
[diagram p3: [05] - REVISION HISTORY.SchDoc]

### Parts
(Parts that share a designator on the sheet are numbered #1, #2 ... from top to bottom, then left to right.)
*?#4  SDTitleBlock  (value not drawn)  (graphical)

### Notes on the sheet
- REVISION HISTORY
- CONFIDENTAL. Do not distribute.
- Variant:
- Checked by
- Designed by THAMKHANH
- (in symbol SDTitleBlock) Title:; Page Contents:; Revision:; Size:; DWG NO; Date:; Sheet; of

## Assembly variants
Production: not fitted C177 C178 C179 C210 C237 C252 C263 C264 C327 C328 C390 C391 C392 C393 C406 C407 C408 C409 C410 C411 C416 C417 C418 C432 C433 D4 D8 D28 D29 D30 D31 D32 D36 D38 D39 FB2 FB8 FB17 FB20 FB26 FB29 FB32 FB35 FB38 FB41 FB42 FB43 L12 LINK1 LINK2 Q14 R15 R21 R24 R41 R52 R53 R54 R57 R58 R60 R65 R67 R68 R70 R87 R93 R104 R110 R114 R117 R119 R121 R123 R126 R128 R135 R138 R147 R148 R158 R159 R167 R168 R171 R174 R177 R178 R182 R191 R197 R199 R203 R207 R208 R209 R210 R211 R215 R216 R217 R234 R236 R239 R245 R250 R258 R261 R266 R271 R272 R274 R281 R282 R287 R290 R291 R294 R295 R298 R304 R310 R313 R316 R322 R325 R328 R331 R334 R335 R336 R337 R338 R339 R340 R341 R342 R343 R344 R347 R350 R352 R355 R357 R359 R360 R365 R367 R368 R371 R373 R374 R376 R378 R383 R385 R386 R387 R388 R392 R393 R394 R395 R396 R400 R401 R403 R408 R411 R412 R413 U17 U30 U34